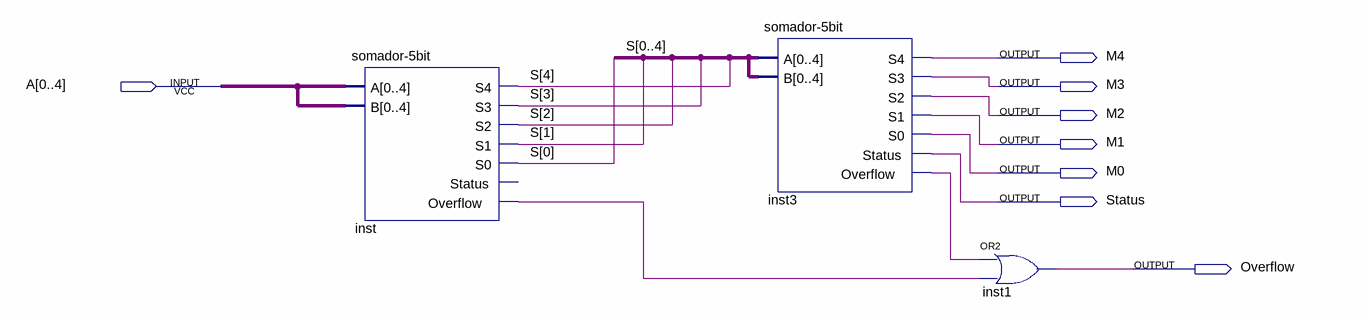
[diagram p0: schematic sheet]
// Quartus schematic a-x-4.bdf as structural Verilog: 3 symbols, 8 pins
module \a-x-4  (
  input  [0:4] A,
  output M4,
  output M3,
  output M2,
  output M1,
  output M0,
  output Status,
  output Overflow
);

  wire inst3_overflow, inst_overflow;
  wire [4:0] S;

  \somador-5bit  inst (
    .A(A), .B(A), .S4(S[4]), .S3(S[3]), .S2(S[2]), .S1(S[1]), .S0(S[0]), .Overflow(inst_overflow));  // open: Status
  \somador-5bit  inst3 (
    .A({S[0], S[1], S[2], S[3], S[4]}), .B({S[0], S[1], S[2], S[3], S[4]}), .S4(M4), .S3(M3), .S2(M2),
    .S1(M1), .S0(M0), .Status(Status), .Overflow(inst3_overflow));
  or inst1 (Overflow, inst3_overflow, inst_overflow);
endmodule
